# EAGLE schematic StellarisRS485 (EAGLE 6.4)
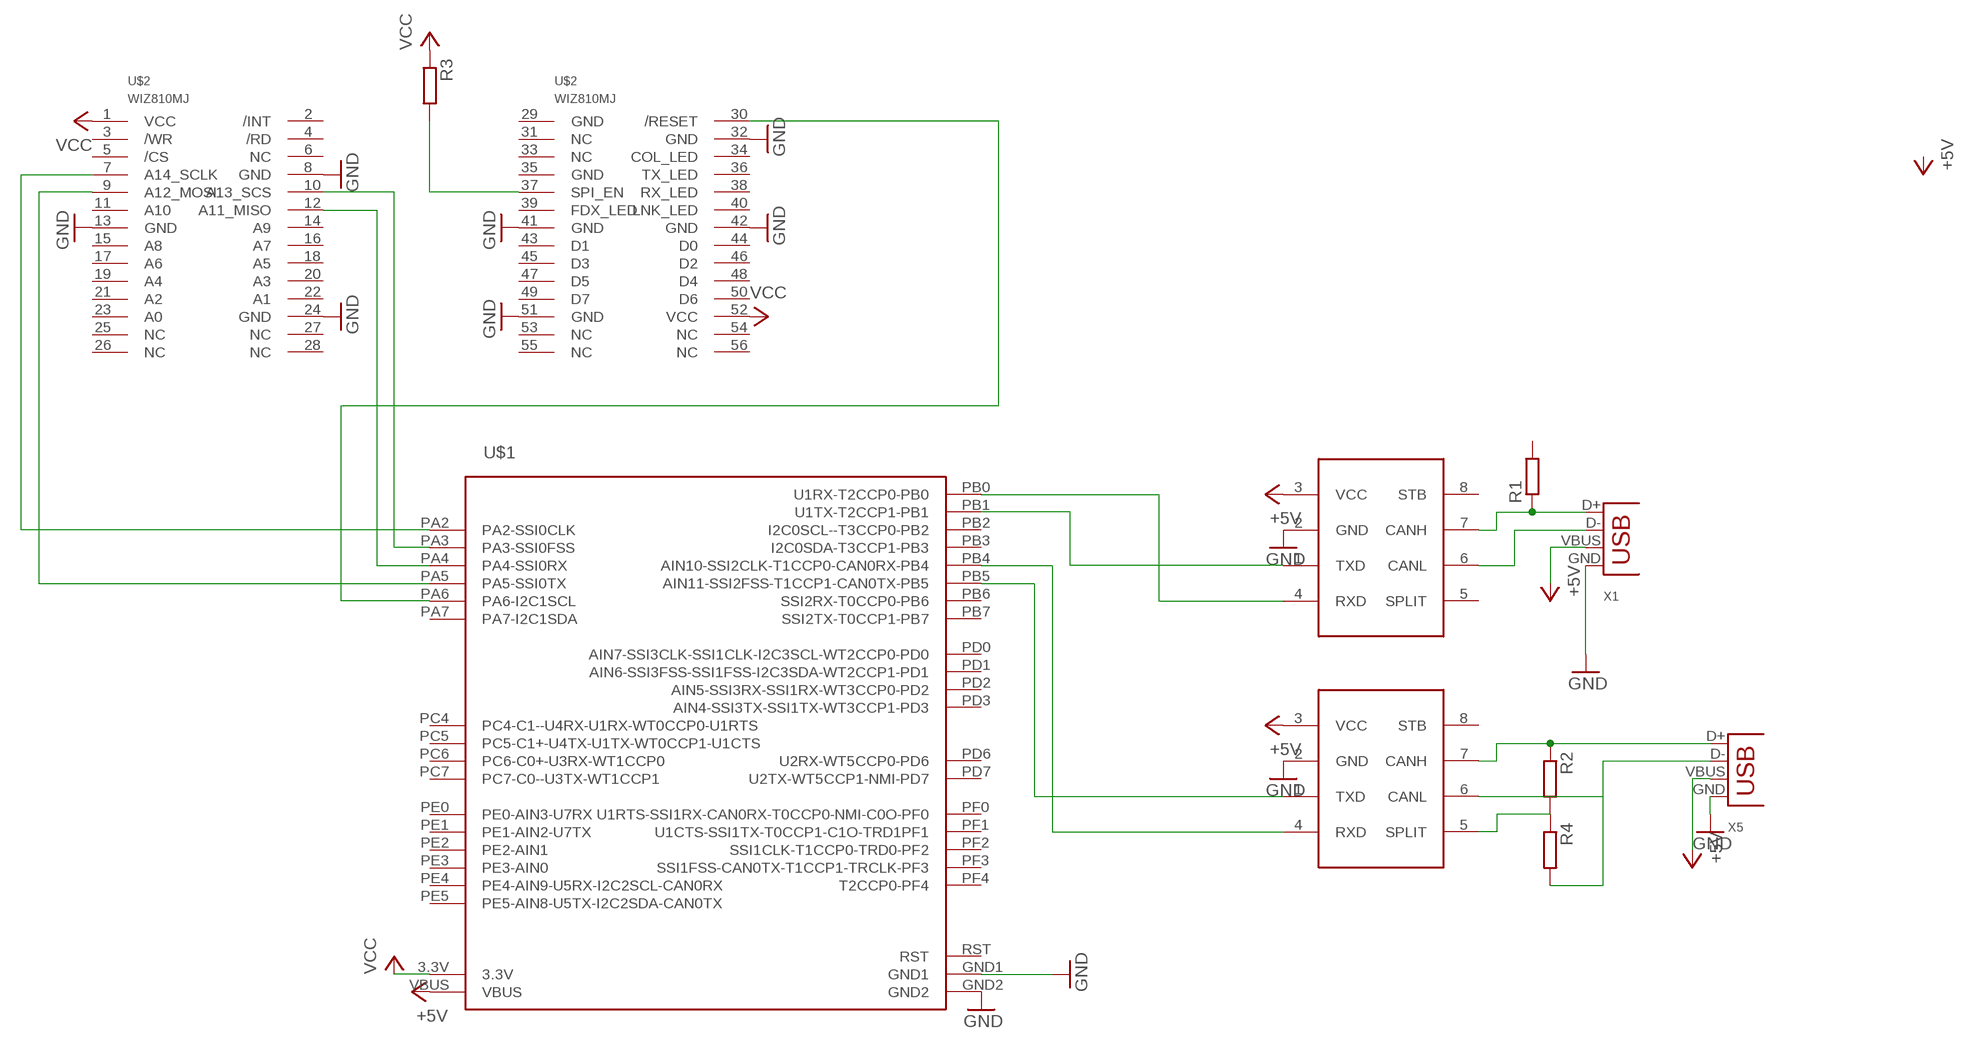
[diagram p0: schematic, sheet 1]

## Parts
R1  R-EU_0207/7  [0207/7]
R2  R-EU_0207/7  [0207/7]
R3  R-EU_0207/7  [0207/7]
R4  R-EU_0207/7  [0207/7]
U$1  STELLARIS-LAUNCHPADSTELLARIS-LAUNCHPAD-XL  [LAUNCHPAD-XL]
U$2  WIZ810MJ  [WIZ810MJ]
U$3  TJA1040  [SOIC8-N_MC]
U$4  TJA1040  [SOIC8-N_MC]
X1  USB-A-H  [USB-A-H]
X5  USB-A-H  [USB-A-H]

## Nets
+5V: U$1.VBUS U$3.3(VCC) U$4.3(VCC) X1.VBUS X5.VBUS
GND: U$1.GND1 U$1.GND2 U$2.8(GND) U$2.13(GND) U$2.24(GND) U$2.32(GND) U$2.41(GND) U$2.42(GND) U$2.51(GND) U$3.2(GND) U$4.2(GND) X1.GND X5.GND
N$1: U$1.PA6(PA6-I2C1SCL) U$2.30(/RESET)
N$2: R1.1 U$3.7(CANH) X1.D+
N$3: U$1.PA2(PA2-SSI0CLK) U$2.7(A14_SCLK)
N$4: U$3.6(CANL) X1.D-
N$5: R2.1 U$4.7(CANH) X5.D+
N$6: U$1.PA5(PA5-SSI0TX) U$2.9(A12_MOSI)
N$7: U$1.PB1(U1TX-T2CCP1-PB1) U$3.1(TXD)
N$8: U$1.PA4(PA4-SSI0RX) U$2.12(A11_MISO)
N$9: U$1.PA3(PA3-SSI0FSS) U$2.10(A13_SCS)
N$10: R3.2 U$2.37(SPI_EN)
N$11: R2.2 R4.1 U$4.5(SPLIT)
N$17: U$1.PB0(U1RX-T2CCP0-PB0) U$3.4(RXD)
N$18: R4.2 U$4.6(CANL) X5.D-
N$19: U$1.PB5(AIN11-SSI2FSS-T1CCP1-CAN0TX-PB5) U$4.1(TXD)
N$20: U$1.PB4(AIN10-SSI2CLK-T1CCP0-CAN0RX-PB4) U$4.4(RXD)
VCC: R3.1 U$2.1(VCC) U$2.52(VCC)
Unconnected: R1.2 U$1.PA7(PA7-I2C1SDA) U$1.PB2(I2C0SCL--T3CCP0-PB2) U$1.PB3(I2C0SDA-T3CCP1-PB3) U$1.PB6(SSI2RX-T0CCP0-PB6) U$1.PB7(SSI2TX-T0CCP1-PB7) U$1.PC4(PC4-C1--U4RX-U1RX-WT0CCP0-U1RTS) U$1.PC5(PC5-C1+-U4TX-U1TX-WT0CCP1-U1CTS) U$1.PC6(PC6-C0+-U3RX-WT1CCP0) U$1.PC7(PC7-C0--U3TX-WT1CCP1) U$1.PD0(AIN7-SSI3CLK-SSI1CLK-I2C3SCL-WT2CCP0-PD0) U$1.PD1(AIN6-SSI3FSS-SSI1FSS-I2C3SDA-WT2CCP1-PD1) U$1.PD2(AIN5-SSI3RX-SSI1RX-WT3CCP0-PD2) U$1.PD3(AIN4-SSI3TX-SSI1TX-WT3CCP1-PD3) U$1.PD6(U2RX-WT5CCP0-PD6) U$1.PD7(U2TX-WT5CCP1-NMI-PD7) U$1.PE0(PE0-AIN3-U7RX) U$1.PE1(PE1-AIN2-U7TX) U$1.PE2(PE2-AIN1) U$1.PE3(PE3-AIN0) U$1.PE4(PE4-AIN9-U5RX-I2C2SCL-CAN0RX) U$1.PE5(PE5-AIN8-U5TX-I2C2SDA-CAN0TX) U$1.PF0(U1RTS-SSI1RX-CAN0RX-T0CCP0-NMI-C0O-PF0) U$1.PF1(U1CTS-SSI1TX-T0CCP1-C1O-TRD1PF1) U$1.PF2(SSI1CLK-T1CCP0-TRD0-PF2) U$1.PF3(SSI1FSS-CAN0TX-T1CCP1-TRCLK-PF3) U$1.PF4(T2CCP0-PF4) U$2.2(/INT) U$2.3(/WR) U$2.4(/RD) U$2.5(/CS) U$2.6(NC) U$2.11(A10) U$2.14(A9) U$2.15(A8) U$2.16(A7) U$2.17(A6) U$2.18(A5) U$2.19(A4) U$2.20(A3) U$2.21(A2) U$2.22(A1) U$2.23(A0) U$2.25(NC) U$2.26(NC) U$2.27(NC) U$2.28(NC) U$2.29(GND) U$2.31(NC) U$2.33(NC) U$2.34(COL_LED) U$2.35(GND) U$2.36(TX_LED) U$2.38(RX_LED) U$2.39(FDX_LED) U$2.40(LNK_LED) U$2.43(D1) U$2.44(D0) U$2.45(D3) U$2.46(D2) U$2.47(D5) U$2.48(D4) U$2.49(D7) U$2.50(D6) U$2.53(NC) U$2.54(NC) U$2.55(NC) U$2.56(NC) U$3.5(SPLIT) U$3.8(STB) U$4.8(STB)

## Power pins joined to a net without a drawn wire
3.3V: U$1.3.3V
RST: U$1.RST

## Library data of the parts
R1-R4 = rcl:R-EU_: RESISTOR, European symbol
U$1 = lieven:STELLARIS-LAUNCHPAD
U$2 = WIZNET:WIZ810MJ
U$3 U$4 = lieven:TJA1040
X1 X5 = lieven:USB: USB Connectors